# Altium schematic sheet comm-rfb.SchDoc
size 297 x 209 mm
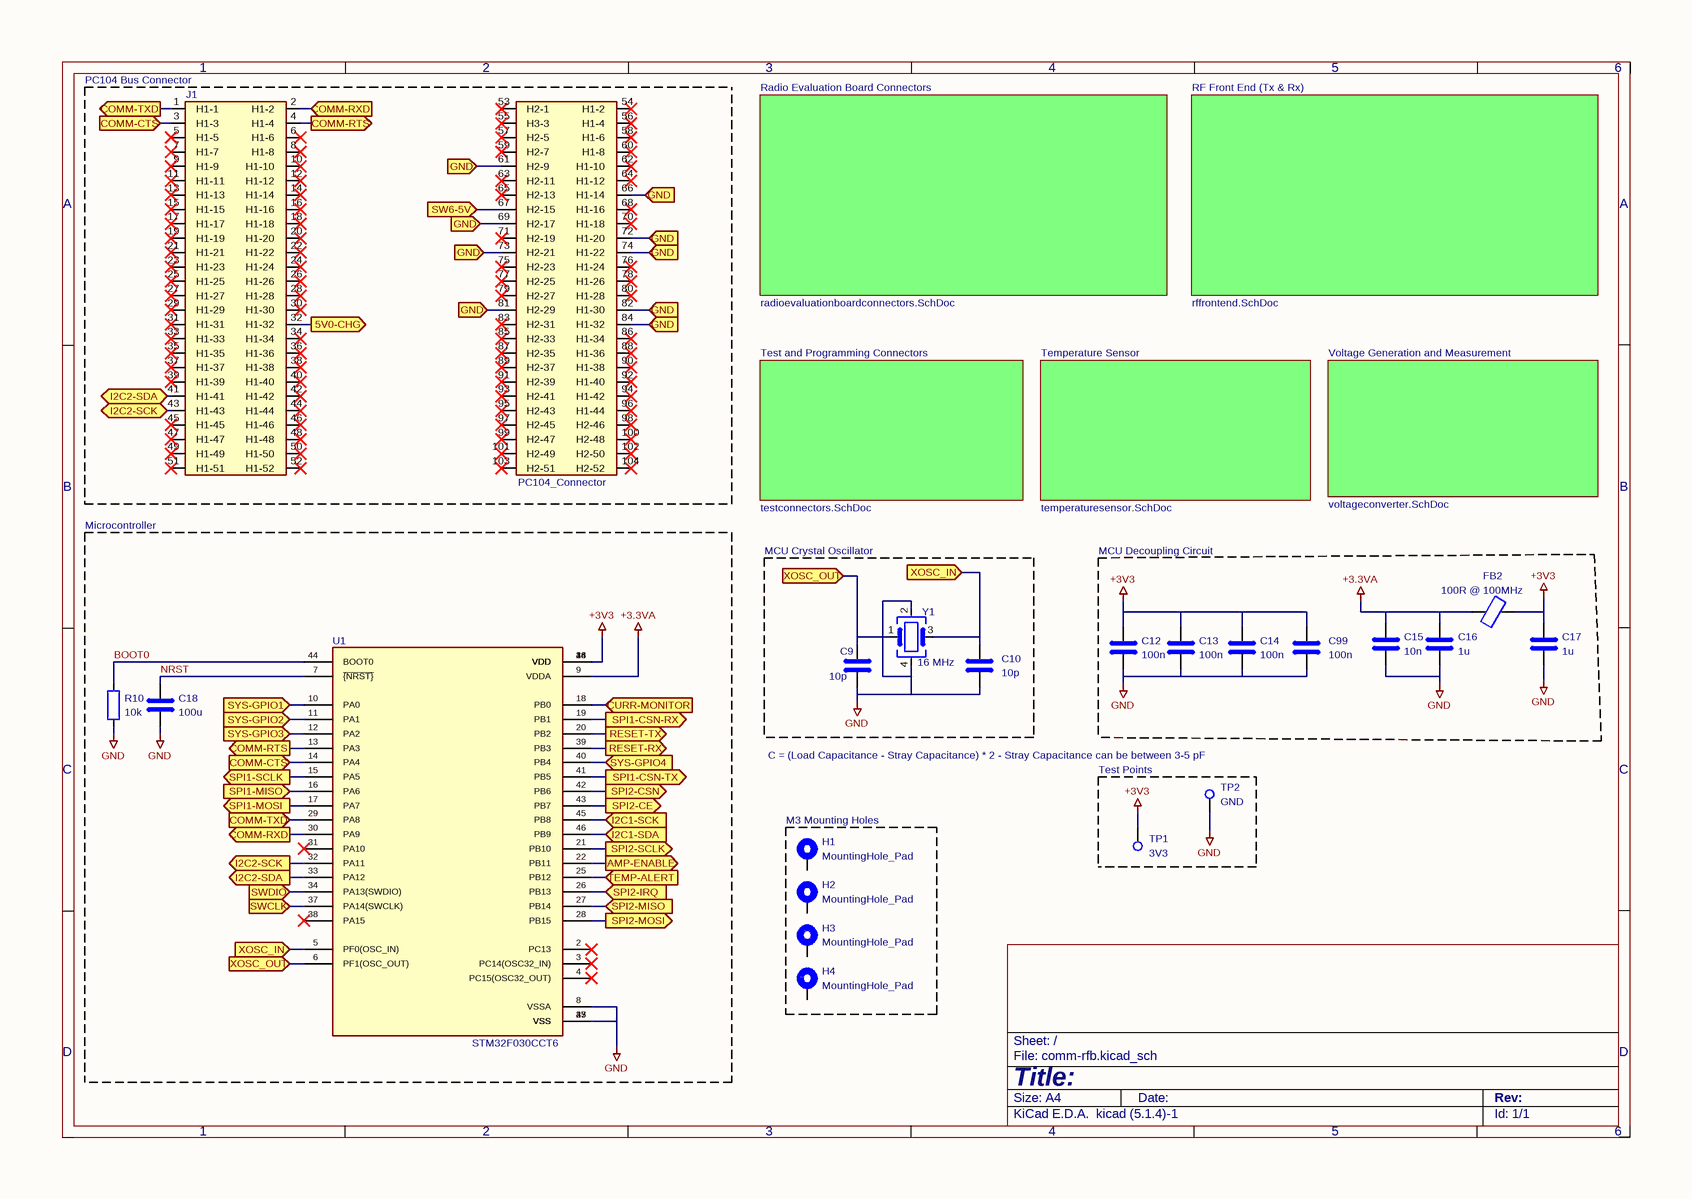
[diagram p0: comm-rfb.SchDoc]

## Parts
C9  10p  [C_0603_1608Metric]
C10  10p  [C_0603_1608Metric]
C12  100n  [C_0603_1608Metric]
C13  100n  [C_0603_1608Metric]
C14  100n  [C_0603_1608Metric]
C15  10n  [C_0603_1608Metric]
C16  1u  [C_0603_1608Metric]
C17  1u  [C_0603_1608Metric]
C18  100u  [C_0603_1608Metric]
C99  100n  [C_0603_1608Metric]
FB2  100R @ 100MHz  [L_0603_1608Metric]
H1  MountingHole_Pad  [MountingHole_3.2mm_M3_Pad_TopBottom]
H2  MountingHole_Pad  [MountingHole_3.2mm_M3_Pad_TopBottom]
H3  MountingHole_Pad  [MountingHole_3.2mm_M3_Pad_TopBottom]
H4  MountingHole_Pad  [MountingHole_3.2mm_M3_Pad_TopBottom]
J1  PC104_Connector  [pc104-connector]
R10  10k  [R_0603_1608Metric]
TP1  3V3  [TestPoint_Pad_D2.0mm]
TP2  GND  [TestPoint_Pad_D2.0mm]
U1  STM32F030CCT6  [QFP50P900X900X160-48N]
Y1  16 MHz  [Crystal_SMD_3225-4Pin_3.2x2.5mm]

## Blocks framed on the sheet
PC104 Bus Connector: J1
Microcontroller: C18 R10 U1
MCU Crystal Oscillator: C9 C10 Y1
Test Points: TP1 TP2
M3 Mounting Holes /: H1-H4

## Sub-sheets
Radio Evaluation Board Connectors = radioevaluationboardconnectors.SchDoc: no entries
RF Front End (Tx & Rx) = rffrontend.SchDoc: no entries
Temperature Sensor = temperaturesensor.SchDoc: no entries
Test and Programming Connectors = testconnectors.SchDoc: no entries
Voltage Generation and Measurement = voltageconverter.SchDoc: no entries

## Ports
5V0-CHG (out), AMP-ENABLE (out), COMM-CTS (in), COMM-RTS (out), COMM-RXD (in), COMM-RXD (out), COMM-TXD (in), COMM-TXD (out), CURR-MONITOR (in), GND (in), I2C1-SCK (in), I2C1-SDA (in), I2C2-SCK (bidir), I2C2-SCK (out), I2C2-SDA (bidir), I2C2-SDA (out), RESET-RX (out), RESET-TX (out), SPI1-CSN-RX (out), SPI1-CSN-TX (out), SPI1-MISO (in), SPI1-MOSI (out), SPI1-SCLK (out), SPI2-CE (out), SPI2-CSN (out), SPI2-IRQ (in), SPI2-MISO (in), SPI2-MOSI (out), SPI2-SCLK (out), SW6-5V (in), SWCLK (in), SWDIO (in), SYS-GPIO1 (in), SYS-GPIO2 (in), SYS-GPIO3 (in), SYS-GPIO4 (in), TEMP-ALERT (in), XOSC_IN (in), XOSC_OUT (in)

## Nets
+3.3VA: C15.1 C16.1 FB2.1 U1.9(VDDA)
+3V3: C12.1 C13.1 C14.1 C17.1 C99.1 FB2.2 TP1.1 U1.1(VDD) U1.24(VDD) U1.36(VDD) U1.48(VDD)
GND: C9.2 C10.2 C12.2 C13.2 C14.2 C15.2 C16.2 C17.2 C18.2 C99.2 R10.2 TP2.1 U1.8(VSSA) U1.23(VSS) U1.35(VSS) U1.47(VSS) Y1.2 Y1.4
5V0-CHG: J1.32(H1-32) ; port 5V0-CHG
AMP-ENABLE: U1.22(PB11) ; port AMP-ENABLE
BOOT0: R10.1 U1.44(BOOT0)
COMM-CTS: J1.3(H1-3) U1.14(PA4) ; port COMM-CTS
COMM-RTS: J1.4(H1-4) U1.13(PA3) ; port COMM-RTS
COMM-RXD: J1.2(H1-2) U1.30(PA9) ; port COMM-RXD
COMM-TXD: J1.1(H1-1) U1.29(PA8) ; port COMM-TXD
CURR-MONITOR: U1.18(PB0) ; port CURR-MONITOR
GND: J1.61(H2-9) J1.66(H1-14) J1.69(H2-17) J1.72(H1-20) J1.73(H2-21) J1.74(H1-22) J1.81(H2-29) J1.82(H1-30) J1.84(H1-32) ; port GND  [a separate net that carries the same name]
I2C1-SCK: U1.45(PB8) ; port I2C1-SCK
I2C1-SDA: U1.46(PB9) ; port I2C1-SDA
I2C2-SCK: J1.43(H1-43) U1.32(PA11) ; port I2C2-SCK
I2C2-SDA: J1.41(H1-41) U1.33(PA12) ; port I2C2-SDA
NRST: C18.1 U1.7(~{{NRST}})
RESET-RX: U1.39(PB3) ; port RESET-RX
RESET-TX: U1.20(PB2) ; port RESET-TX
SPI1-CSN-RX: U1.19(PB1) ; port SPI1-CSN-RX
SPI1-CSN-TX: U1.41(PB5) ; port SPI1-CSN-TX
SPI1-MISO: U1.16(PA6) ; port SPI1-MISO
SPI1-MOSI: U1.17(PA7) ; port SPI1-MOSI
SPI1-SCLK: U1.15(PA5) ; port SPI1-SCLK
SPI2-CE: U1.43(PB7) ; port SPI2-CE
SPI2-CSN: U1.42(PB6) ; port SPI2-CSN
SPI2-IRQ: U1.26(PB13) ; port SPI2-IRQ
SPI2-MISO: U1.27(PB14) ; port SPI2-MISO
SPI2-MOSI: U1.28(PB15) ; port SPI2-MOSI
SPI2-SCLK: U1.21(PB10) ; port SPI2-SCLK
SW6-5V: J1.67(H2-15) ; port SW6-5V
SWCLK: U1.37(PA14(SWCLK)) ; port SWCLK
SWDIO: U1.34(PA13(SWDIO)) ; port SWDIO
SYS-GPIO1: U1.10(PA0) ; port SYS-GPIO1
SYS-GPIO2: U1.11(PA1) ; port SYS-GPIO2
SYS-GPIO3: U1.12(PA2) ; port SYS-GPIO3
SYS-GPIO4: U1.40(PB4) ; port SYS-GPIO4
TEMP-ALERT: U1.25(PB12) ; port TEMP-ALERT
XOSC_IN: C10.1 U1.5(PF0(OSC_IN)) Y1.3 ; port XOSC_IN
XOSC_OUT: C9.1 U1.6(PF1(OSC_OUT)) Y1.1 ; port XOSC_OUT

Not connected (* = marked no-connect by the designer): H1 1; H2 1; H3 1; H4 1; J1 5(H1-5)* 6(H1-6)* 7(H1-7)* 8(H1-8)* 9(H1-9)* 10(H1-10)* 11(H1-11)* 12(H1-12)* 13(H1-13)* 14(H1-14)* 15(H1-15)* 16(H1-16)* 17(H1-17)* 18(H1-18)* 19(H1-19)* 20(H1-20)* 21(H1-21)* 22(H1-22)* 23(H1-23)* 24(H1-24)* 25(H1-25)* 26(H1-26)* 27(H1-27)* 28(H1-28)* 29(H1-29)* 30(H1-30)* 31(H1-31)* 33(H1-33)* 34(H1-34)* 35(H1-35)* 36(H1-36)* 37(H1-37)* 38(H1-38)* 39(H1-39)* 40(H1-40)* 42(H1-42)* 44(H1-44)* 45(H1-45)* 46(H1-46)* 47(H1-47)* 48(H1-48)* 49(H1-49)* 50(H1-50)* 51(H1-51)* 52(H1-52)* 53(H2-1)* 54(H1-2)* 55(H3-3)* 56(H1-4)* 57(H2-5)* 58(H1-6)* 59(H2-7)* 60(H1-8)* 62(H1-10)* 63(H2-11)* 64(H1-12)* 65(H2-13)* 68(H1-16)* 70(H1-18)* 71(H2-19)* 75(H2-23)* 76(H1-24)* 77(H2-25)* 78(H1-26)* 79(H2-27)* 80(H1-28)* 83(H2-31)* 85(H2-33)* 86(H1-34)* 87(H2-35)* 88(H1-36)* 89(H2-37)* 90(H1-38)* 91(H2-39)* 92(H1-40)* 93(H2-41)* 94(H1-42)* 95(H2-43)* 96(H1-44)* 97(H2-45)* 98(H2-46)* 99(H2-47)* 100(H2-48)* 101(H2-49)* 102(H2-50)* 103(H2-51)* 104(H2-52)*; U1 2(PC13)* 3(PC14(OSC32_IN))* 4(PC15(OSC32_OUT))* 31(PA10)* 38(PA15)*

## Notes on the sheet
- MCU Decoupling Circuit
- (near TP2) C = (Load Capacitance - Stray Capacitance) * 2
  - Stray Capacitance can be between 3-5 pF
- 1
- 2
- 3
- 4
- 5
- 6
- A
- B
- C
- D
- Title:
- File: comm-rfb.kicad_sch
- Sheet: /
- KiCad E.D.A.  kicad (5.1.4)-1
- Size: A4
- Date:
- Rev:
- Id: 1/1

## Library data of the parts
C9 C10 C12-C18 C99 = C: Footprint: Capacitor_SMD:C_0603_1608Metric
  C9 C10: Value: 10p
  C12-C14 C99: Value: 100n
  C15: Value: 10n
  C16 C17: Value: 1u
  C18: Value: 100u
FB2 = FerriteBead: Value: 100R @ 100MHz; Footprint: Inductor_SMD:L_0603_1608Metric
R10 = R: Value: 10k; Footprint: Resistor_SMD:R_0603_1608Metric
TP1 TP2 = TestPoint: Footprint: TestPoint:TestPoint_Pad_D2.0mm
  TP1: Value: 3V3
  TP2: Value: GND
U1 = STM32F030CCT6: MANUFACTURER: STMicroelectronics; Value: STM32F030CCT6; Footprint: qset-footprints:QFP50P900X900X160-48N
Y1 = Crystal_GND24: Value: 16 MHz; Footprint: Crystal:Crystal_SMD_3225-4Pin_3.2x2.5mm
H1-H4 = MountingHole_Pad: Value: MountingHole_Pad; Footprint: MountingHole:MountingHole_3.2mm_M3_Pad_TopBottom
J1 = PC104_Connector: Value: PC104_Connector; Footprint: pc104-template:pc104-connector